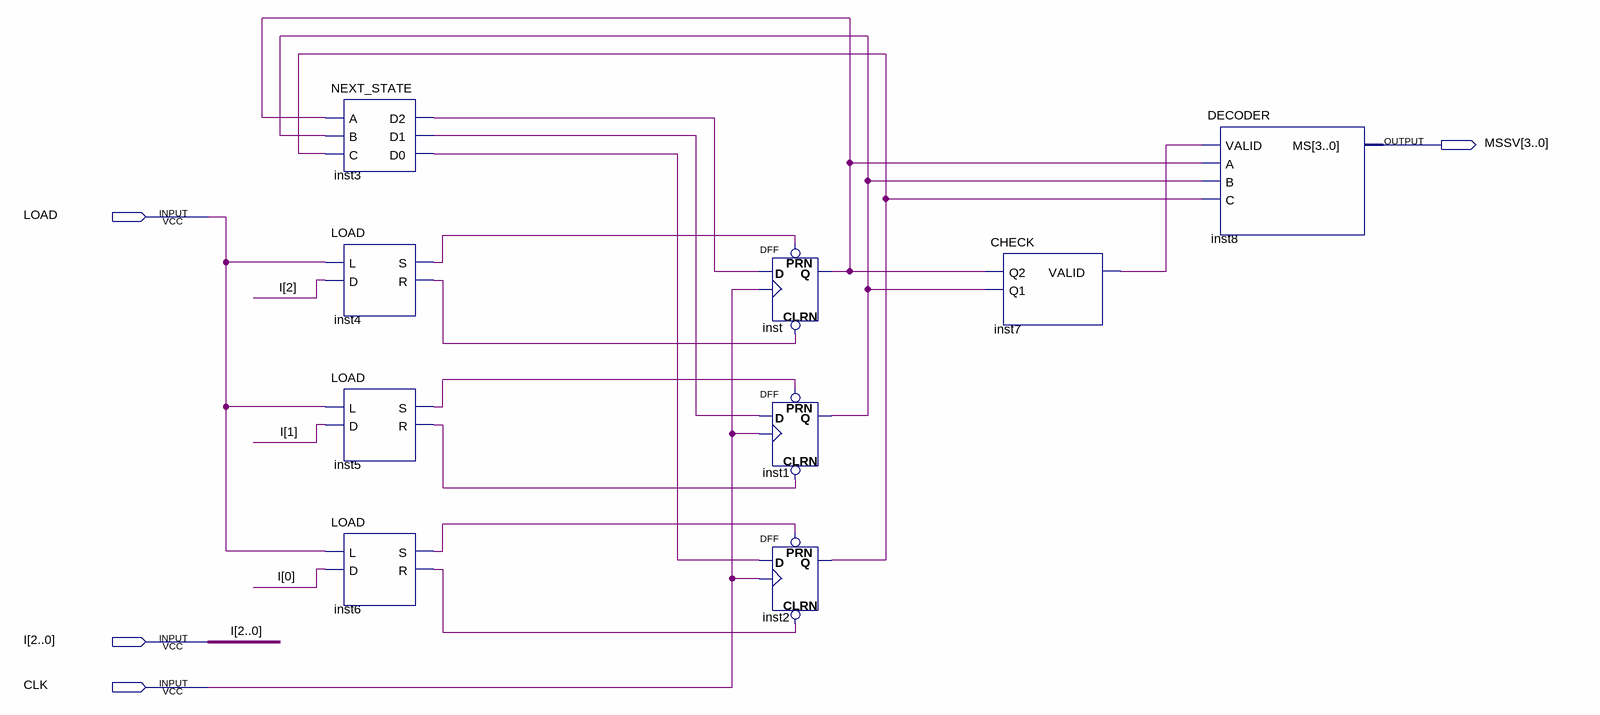
[diagram p0: schematic sheet]
// Quartus schematic Lab1_21521810.bdf as structural Verilog: 9 symbols, 4 pins
module Lab1_21521810 (
  input  LOAD,
  input  [2:0] I,
  input  CLK,
  output [3:0] MSSV
);

  wire inst1_q, inst2_q, inst3_d0, inst3_d1, inst3_d2, inst4_r, inst4_s, inst5_r, inst5_s, inst6_r, inst6_s,
       inst7_valid, inst_q;

  NEXT_STATE inst3 (.A(inst_q), .B(inst1_q), .C(inst2_q), .D2(inst3_d2), .D1(inst3_d1), .D0(inst3_d0));
  LOAD inst4 (.L(LOAD), .D(I[2]), .S(inst4_s), .R(inst4_r));
  LOAD inst5 (.L(LOAD), .D(I[1]), .S(inst5_s), .R(inst5_r));
  LOAD inst6 (.L(LOAD), .D(I[0]), .S(inst6_s), .R(inst6_r));
  DFF inst (.CLRN(inst4_r), .CLK(CLK), .D(inst3_d2), .PRN(inst4_s), .Q(inst_q));
  DFF inst1 (.CLRN(inst5_r), .CLK(CLK), .D(inst3_d1), .PRN(inst5_s), .Q(inst1_q));
  DFF inst2 (.CLRN(inst6_r), .CLK(CLK), .D(inst3_d0), .PRN(inst6_s), .Q(inst2_q));
  CHECK inst7 (.Q2(inst_q), .Q1(inst1_q), .VALID(inst7_valid));
  DECODER inst8 (.VALID(inst7_valid), .A(inst_q), .B(inst1_q), .C(inst2_q), .MS(MSSV));
endmodule
